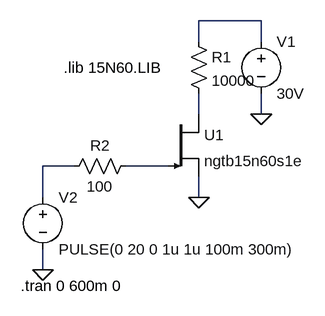
[diagram p0: schematic Draft2.asc]
Draft2.asc, the LTspice schematic file:
Version 4
SHEET 1 924 680
WIRE 304 -48 208 -48
WIRE 208 -16 208 -48
WIRE 304 -16 304 -48
WIRE 208 96 208 64
WIRE 304 96 304 64
WIRE 16 176 -32 176
WIRE 160 176 96 176
WIRE -32 224 -32 176
WIRE 208 224 208 192
WIRE -32 336 -32 304
FLAG 208 224 0
FLAG 304 96 0
FLAG -32 336 0
SYMBOL Misc\\nigbt 160 96 R0
SYMATTR InstName U1
SYMATTR Value ngtb15n60s1e
SYMBOL res 192 -32 R0
SYMATTR InstName R1
SYMATTR Value 10000
SYMATTR SpiceLine tol=1 pwr=0.1
SYMBOL voltage 304 -32 R0
SYMATTR InstName V1
SYMATTR Value 30V
SYMBOL res 0 192 R270
WINDOW 0 32 56 VTop 2
WINDOW 3 0 56 VBottom 2
SYMATTR InstName R2
SYMATTR Value 100
SYMATTR SpiceLine tol=1 pwr=0.1
SYMBOL voltage -32 208 R0
WINDOW 123 0 0 Left 2
WINDOW 39 0 0 Left 2
SYMATTR InstName V2
SYMATTR Value PULSE(0 20 0 1u 1u 100m 300m)
TEXT -66 360 Left 2 !.tran 0 600m 0
TEXT 0 24 Left 2 !.lib 15N60.LIB

The netlist it stands for:
* Draft2.asc
Z§U1 N002 N004 0 ngtb15n60s1e
R1 N001 N002 10000 tol=1 pwr=0.1
V1 N001 0 30V
R2 N003 N004 100 tol=1 pwr=0.1
V2 N003 0 PULSE(0 20 0 1u 1u 100m 300m)
.tran 0 600m 0
.lib 15N60.LIB
.backanno
.end